# EAGLE design PSU (EAGLE 6.0)
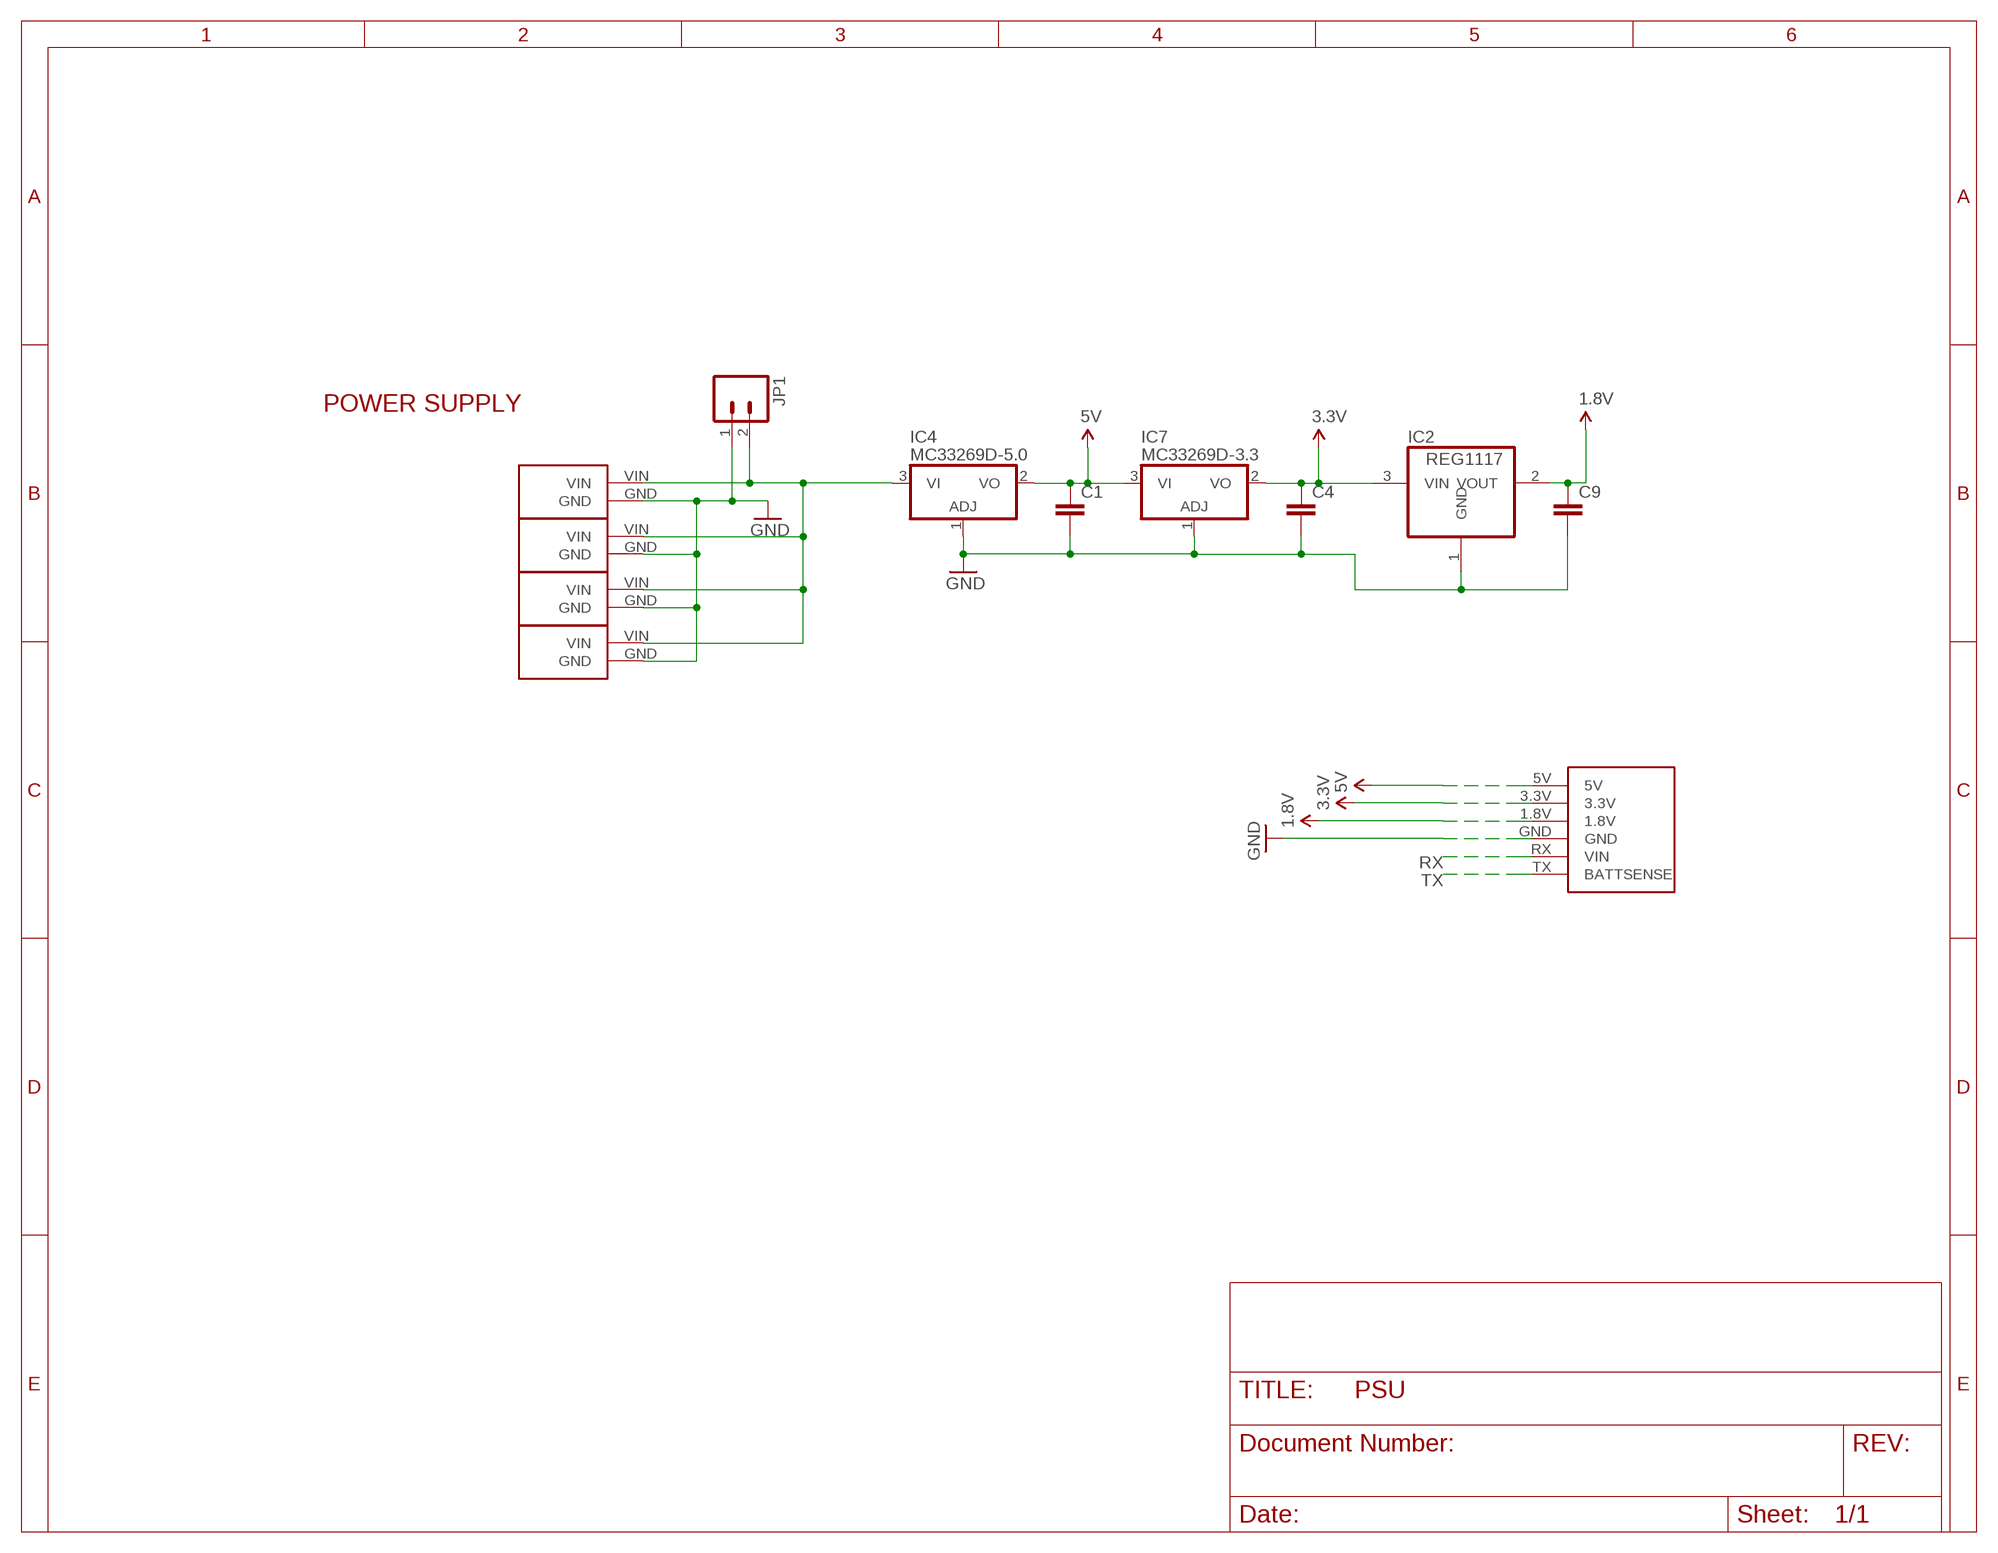
[diagram p0: schematic, sheet 1]

## Parts
C1  CAP0805  [0805]
C4  CAP0805  [0805]
C9  CAP0805  [0805]
IC2  REG1117  [SOT223]
IC4  MC33269D-5.0  [DPACK]
IC7  MC33269D-3.3  [DPACK]
JP1  M02PTH4  [1X02_XTRA_BIG]
QB1  QUADBOARD  [QUADBOARD]
U$2  ESC_POWER  [ESCPOWER]
U$3  ESC_POWER  [ESCPOWER]
U$4  ESC_POWER  [ESCPOWER]
U$5  ESC_POWER  [ESCPOWER]

## Nets
1.8V: C9.1 IC2.2(VOUT) QB1.1.8V
3.3V: C4.1 IC2.3(VIN) IC7.2(VO) QB1.3.3V
5V [POWER]: C1.1 IC4.2(VO) IC7.3(VI) QB1.5V
GND: C1.2 C4.2 C9.2 IC2.1(GND) IC4.1(ADJ) IC7.1(ADJ) JP1.1 QB1.GND U$2.GND U$3.GND U$4.GND U$5.GND
RX: QB1.RX(VIN)
TX: QB1.TX(BATTSENSE)
VIN [POWER]: IC4.3(VI) JP1.2 U$2.VIN U$3.VIN U$4.VIN U$5.VIN

## Notes on the sheet
- POWER SUPPLY

## Library data of the parts
C1 C4 C9 = SparkFun:CAP: Capacitor Standard 0603 ceramic capacitor, and 0.1" leaded capacitor.
IC2 = burr-brown:REG1117: 800mA and 1A Low Dropout (LDO) Positive Regulator 1.8V, 2.5V, 2.85V, 3.3V, 5V, and Adj; MPN: REG1117; OC_FARNELL: 1097566; OC_NEWARK: 14P6981
IC4 IC7 = linear:MC33269?*: Adjustable Output Low Dropout Voltage Regulator 800 mA Source: http://www.onsemi.com/pub/Collateral/MC33269-D.PDF
JP1 = SparkFun:M02: Header 2 Standard 2-pin 0.1" header. Use with straight break away headers (SKU : PRT-00116), right angle break away headers (PRT-00553), swiss pins (PRT-00743), machine pins (PRT-00117), and female headers (PRT-00115). Molex polarized connector foot print use with SKU : PRT-08233 with associated crimp pins and housings.
QB1 = terrys:QUADBOARD
U$2-U$5 = terrys:ESC_POWER

## Net classes
1 POWER: width 0.508 mm, drill 0.406 mm, clearance 0.254 mm

## Board
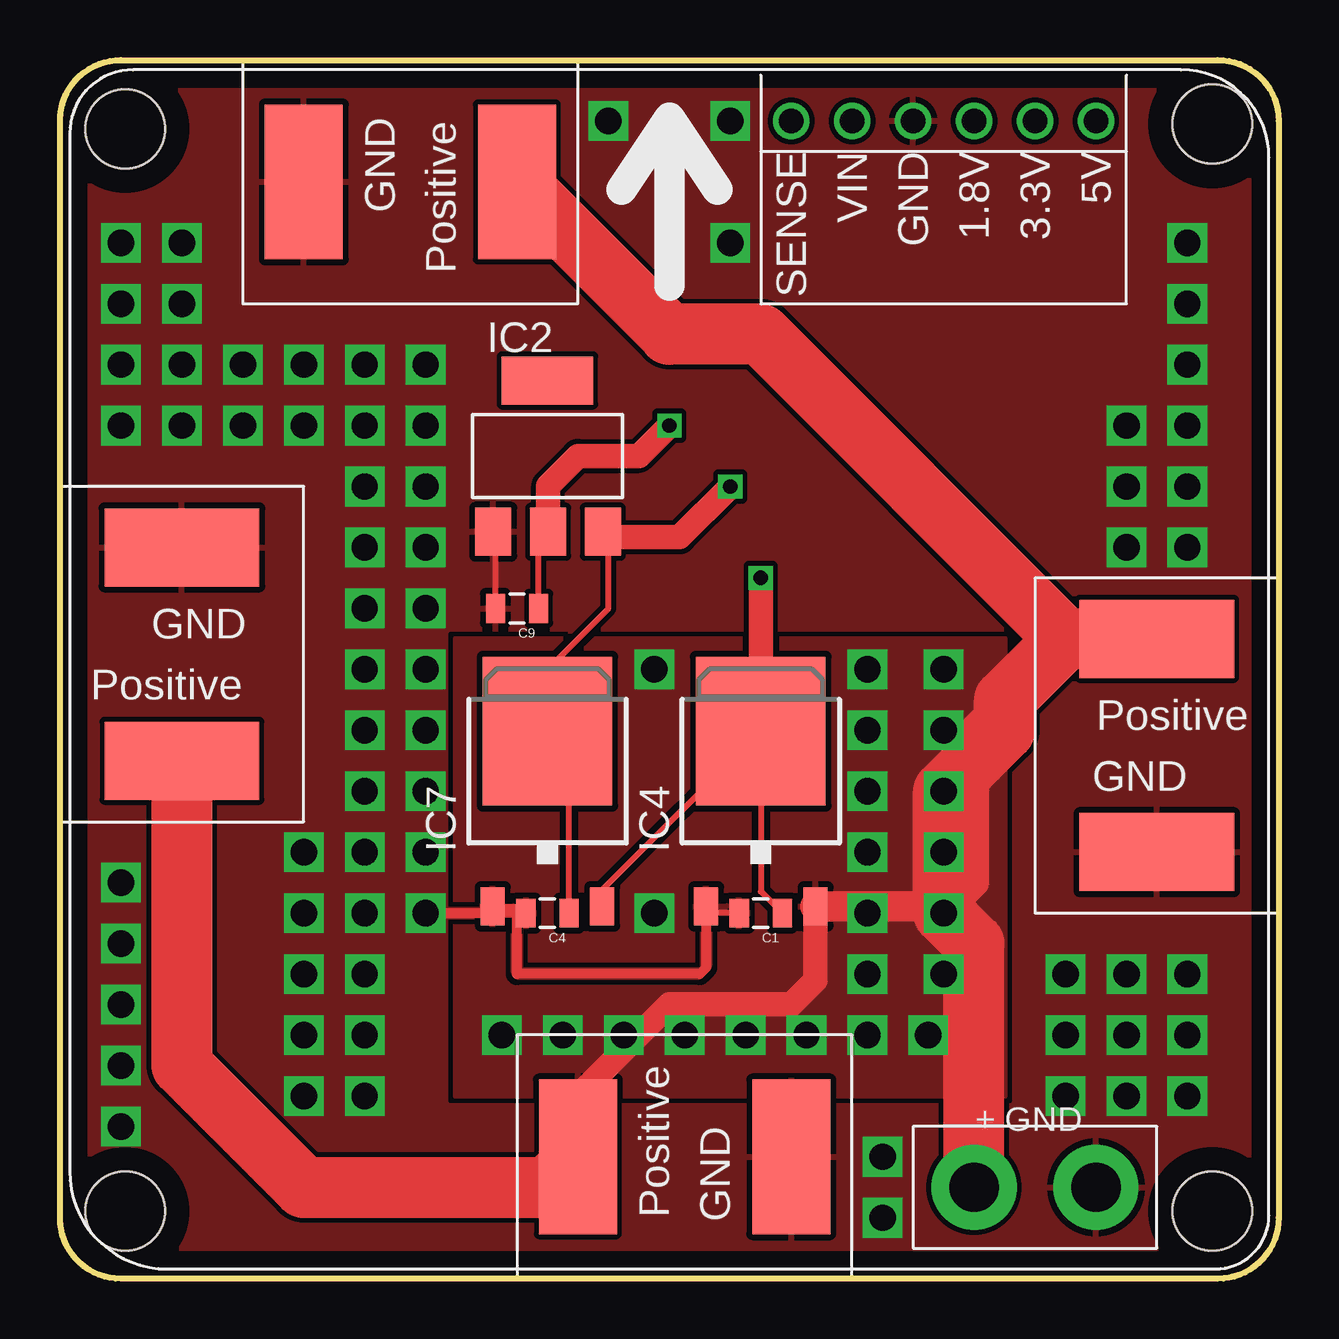
[diagram p1: board, top side]
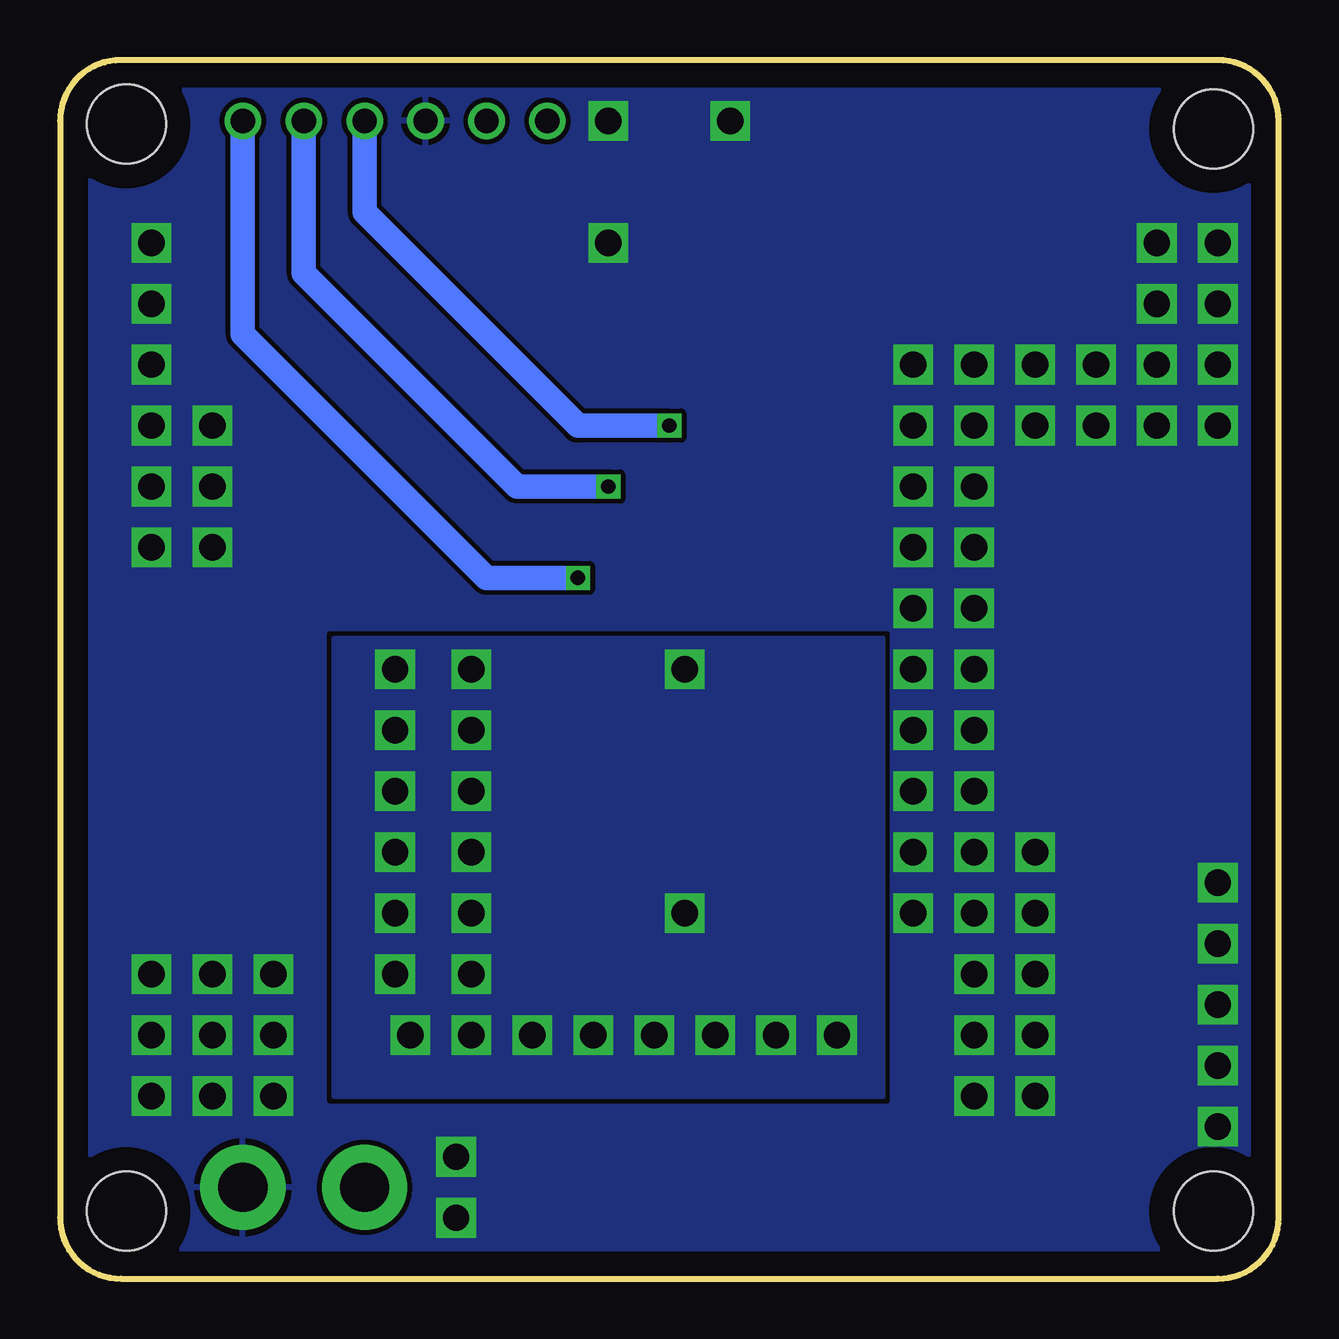
[diagram p2: board, bottom side, seen from below]

Size 50.8 x 50.8 mm. Coordinates in mm from the lower left corner, seen from the top.
Outline: 2.54,0 arc-90 0,2.54 0,48.26 arc-90 2.54,50.8 48.26,50.8 arc-90 50.8,48.26 50.8,2.54 arc-90 48.26,0 2.54,0
Copper layers (1*16): Top 0.035mm / dielectric 1.5mm / Bottom 0.035mm
Design rules: minimum track width 10mil, minimum drill 24mil, track to track 8mil, track to pad 8mil, pad to pad 8mil, via to via 8mil, smd to smd 8mil, copper to edge 40mil, drill to drill 8mil, minimum pad ring 10mil, minimum via ring 8mil, stop-mask expansion 4mil, vias tented up to drill 0mil, thermal gap 10mil

### Footprints (pad centres in the part's own frame; a part is rotated, then mirrored left to right if it is on the bottom)
0805 = smd 0.8 x 1.2: 1 -0.9,0; 2 0.9,0
SOT223 = smd 1.499 x 2.007: 1 -2.261,-3.15; 2 0.025,-3.15; 3 2.311,-3.15 | smd 3.81 x 2.007: 4 0,3.15
DPACK = smd 1 x 1.6: 1 -2.28,-4.8; 3 2.28,-4.8 | smd 5.4 x 6.2: 2 0,2.5
1X02_XTRA_BIG = drill 2.057 pad 3.556: 1 -2.54,0; 2 2.54,0
QUADBOARD = drill 1.016: 1.8V 12.7,22.86; 3.3V 15.24,22.86; 5V 17.78,22.86; GND 10.16,22.86; RX 7.62,22.86; TX 5.08,22.86
ESCPOWER = smd 6.452 x 3.251: GND 0,3.81; VIN 0,-5.08
STAND-OFF = hole 3.302: 0,0

### Placement (x,y rotation side)
C1  29.21,15.24 180 top
C4  20.32,15.24 180 top
C9  19.05,27.94 180 top
IC2  20.32,34.29 0 top
IC4  29.21,20.32 0 top
IC7  20.32,20.32 0 top
JP1  40.64,3.81 180 top
QB1  25.4,25.4 0 top
U$2  13.97,45.72 90 top
U$3  5.08,26.67 0 top
U$4  26.67,5.08 270 top
U$5  45.72,21.59 180 top
U$6  5V  [STAND-OFF]  2.72,47.93 0 top
U$7  5V  [STAND-OFF]  48.03,48.13 0 top
U$8  5V  [STAND-OFF]  2.72,2.82 0 top
U$9  5V  [STAND-OFF]  48.03,2.82 0 top

### Tracks (layer width: path | path; a pad name or v marks a point on that pad's centre or on a via)
1.8V  (via drill 0.6)
  Top 0.254: C9.1 19.95,30.75 IC2.2
  Top 1.016: IC2.2 20.34,33.05 21.59,34.29 24.13,34.29 v25.4,35.56
  Bottom 1.016: v25.4,35.56 29.21,35.56 38.1,44.45 QB1.1.8V
3.3V  (via drill 0.6)
  Top 0.254: IC2.3 22.86,30.91 22.86,27.94 20.32,25.4 IC7.2 21.22,21.92 C4.1
  Top 1.016: 22.86,30.91 25.83,30.91 v27.94,33.02
  Bottom 1.016: v27.94,33.02 31.75,33.02 40.64,41.91 QB1.3.3V
5V  (via drill 0.6)
  Top 0.254: C1.1 29.21,16.14 IC4.2 22.6,16.21 IC7.3
  Top 1.016: IC4.2 v29.21,29.21
  Bottom 1.016: v29.21,29.21 33.02,29.21 43.18,39.37 QB1.5V
GND  (via drill 1.1)
  Top 0.254: C9.2 18.15,31.05 IC2.1 | IC7.1 18.04,15.5 | 18.04,15.5 17.78,15.24 | C1.2 27.21,15.24 IC4.1 | 18.04,15.5 19.16,15.5 C4.2
  Top 0.406: IC4.1 26.93,12.96 26.67,12.7 19.05,12.7 19.05,15.24 17.78,15.24 | v15.24,15.24 17.76,15.24 IC7.1
  other vias: 2.54,43.18 5.08,43.18 5.08,40.64 2.54,40.64 2.54,38.1 5.08,38.1 7.62,38.1 10.16,38.1 12.7,38.1 12.7,35.56 10.16,35.56 7.62,35.56 5.08,35.56 2.54,35.56 12.7,33.02 12.7,30.48 12.7,27.94 12.7,25.4 12.7,22.86 12.7,20.32 12.7,17.78 12.7,15.24 12.7,12.7 12.7,10.16 12.7,7.62 10.16,7.62 10.16,10.16 10.16,12.7 10.16,15.24 10.16,17.78 15.24,17.78 15.24,20.32 15.24,22.86 15.24,25.4 15.24,27.94 15.24,30.48 15.24,33.02 15.24,35.56 15.24,38.1 41.91,12.7 44.45,12.7 46.99,12.7 34.29,5.08 34.29,2.54 46.99,30.48 46.99,33.02 46.99,35.56 46.99,38.1 46.99,40.64 46.99,43.18 44.45,30.48 44.45,33.02 44.45,35.56 22.86,48.26 27.94,48.26 27.94,43.18 2.54,16.51 2.54,13.97 2.54,11.43 2.54,8.89 2.54,6.35 41.91,10.16 41.91,7.62 44.45,10.16 46.99,10.16 46.99,7.62 44.45,7.62
  pour Bottom (rank 6): 0,50.8 50.8,50.8 50.8,0 0,0
  pour Top (rank 6): 0,50.8 50.8,50.8 50.8,0 0,0
VIN  (via drill 1.1)
  Top 1.016: IC4.3 31.49,12.44 30.48,11.43 25.4,11.43 21.59,7.62 U$4.VIN
  Top 1.27: IC4.3 37.11,15.52 38.1,16.51 38.1,22.86 41.91,26.67
  Top 2.54: U$3.VIN 5.08,8.89 10.16,3.81 20.32,3.81 U$4.VIN | U$5.VIN 41.91,26.67 | 41.91,26.67 29.21,39.37 25.4,39.37 U$2.VIN | JP1.2 38.1,13.97 v36.83,15.24 v36.83,20.32 39.37,22.86 39.37,24.13 41.91,26.67
  other vias: 36.83,25.4 36.83,22.86 36.83,17.78 36.83,12.7 24.77,15.24 24.77,25.4 18.41,10.16 20.95,10.16 23.5,10.16 26.04,10.16 28.57,10.16 31.11,10.16 33.66,10.16 36.2,10.16 33.66,12.7 33.66,15.24 33.66,17.78 33.66,20.32 33.66,22.86 33.66,25.4
  pour Bottom: 16.51,26.67 39.37,26.67 39.37,7.62 16.51,7.62
  pour Top: 16.51,26.67 39.37,26.67 39.37,7.62 16.51,7.62

### Text on the board
tPlace: + GND